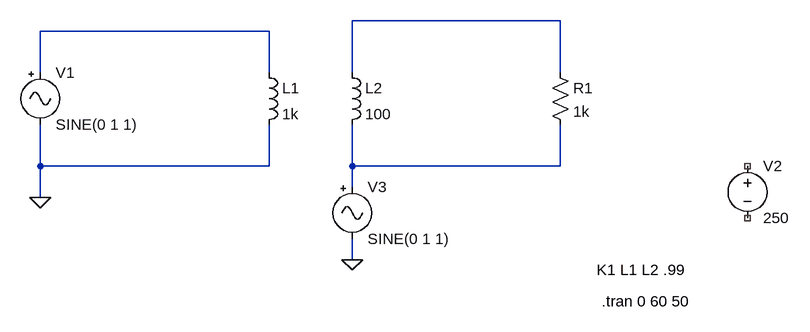
[diagram p0: schematic Transformer_Isolation.asc]
Transformer_Isolation.asc, the LTspice schematic file:
Version 4.1
SHEET 1 1272 680
WIRE 912 48 592 48
WIRE 464 64 112 64
WIRE 112 128 112 64
WIRE 464 128 464 64
WIRE 592 128 592 48
WIRE 912 128 912 48
WIRE 112 272 112 208
WIRE 464 272 464 208
WIRE 464 272 112 272
WIRE 592 272 592 208
WIRE 912 272 912 208
WIRE 912 272 592 272
WIRE 592 304 592 272
WIRE 112 320 112 272
WIRE 592 416 592 384
FLAG 592 416 0
FLAG 112 320 0
SYMBOL Misc\\signal 112 112 R0
WINDOW 123 0 0 Left 0
WINDOW 39 0 0 Left 0
SYMATTR InstName V1
SYMATTR Value SINE(0 1 1)
SYMBOL ind 448 112 R0
SYMATTR InstName L1
SYMATTR Value 1k
SYMATTR Type ind
SYMATTR SpiceLine Rser=1u
SYMBOL ind 576 112 R0
SYMATTR InstName L2
SYMATTR Value 100
SYMATTR Type ind
SYMATTR SpiceLine Rser=0
SYMBOL res 896 112 R0
SYMATTR InstName R1
SYMATTR Value 1k
SYMBOL voltage 1200 256 R0
WINDOW 123 0 0 Left 0
WINDOW 39 0 0 Left 0
SYMATTR InstName V2
SYMATTR Value 250
SYMBOL Misc\\signal 592 288 R0
WINDOW 123 0 0 Left 0
WINDOW 39 0 0 Left 0
SYMATTR InstName V3
SYMATTR Value SINE(0 1 1)
TEXT 968 432 Left 2 !K1 L1 L2 .99
TEXT 976 480 Left 2 !.tran 0 60 50

The netlist it stands for:
* Transformer_Isolation.asc
V1 N002 0 SINE(0 1 1)
L1 N002 0 1k Rser=1u
L2 N001 N003 100 Rser=0
R1 N001 N003 1k
V2 NC_01 NC_02 250
V3 N003 0 SINE(0 1 1)
K1 L1 L2 .99
.tran 0 60 50
.backanno
.end